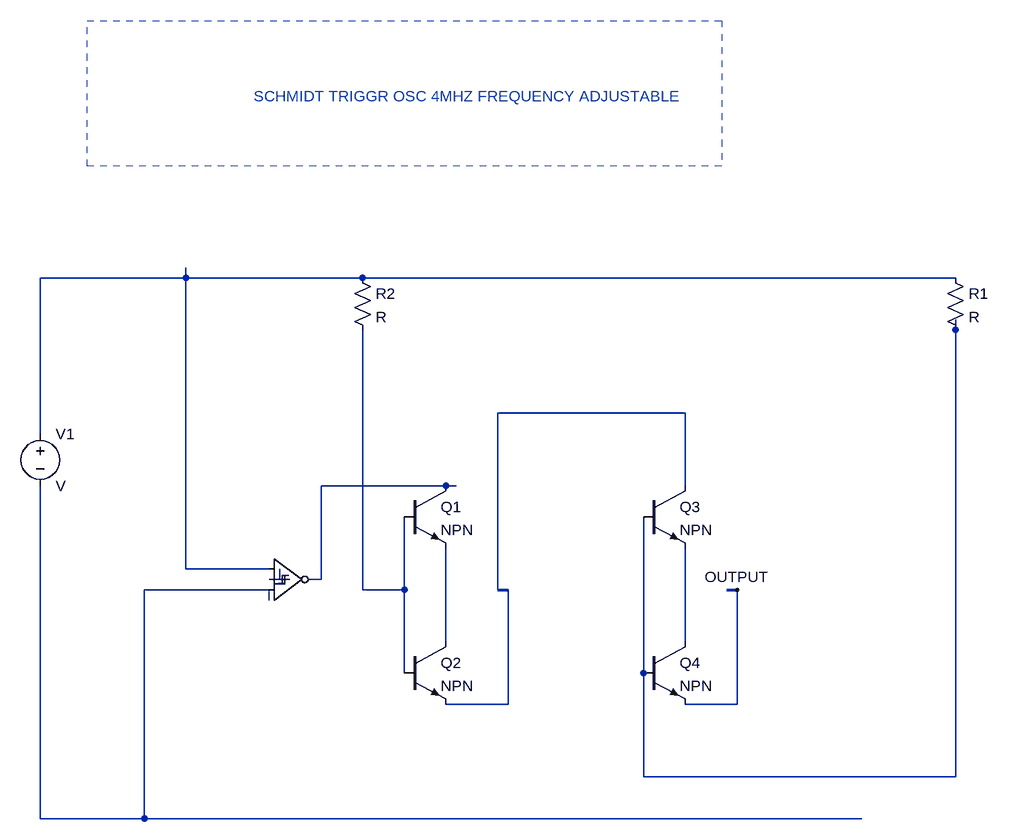
[diagram p0: schematic oscillatorModulatorQuartz.asc]
oscillatorModulatorQuartz.asc, the LTspice schematic file:
Version 4
SHEET 1 880 680
WIRE -480 -368 -480 -384
WIRE -480 -368 -704 -368
WIRE -208 -368 -480 -368
WIRE 704 -368 -208 -368
WIRE 704 -288 704 -304
WIRE 288 -160 0 -160
WIRE -704 -128 -704 -368
WIRE -80 -48 -272 -48
WIRE -64 -48 -80 -48
WIRE 288 -48 288 -160
WIRE -480 80 -480 -368
WIRE -352 80 -480 80
WIRE -336 96 -336 80
WIRE -272 96 -272 -48
WIRE -272 96 -288 96
WIRE -352 112 -544 112
WIRE -208 112 -208 -288
WIRE -144 112 -144 0
WIRE -144 112 -208 112
WIRE 0 112 0 -160
WIRE -80 192 -80 48
WIRE 288 192 288 48
WIRE -144 240 -144 112
WIRE 224 240 224 0
WIRE 16 288 16 112
WIRE 16 288 -80 288
WIRE 368 288 368 112
WIRE 368 288 288 288
WIRE 224 400 224 240
WIRE 704 400 704 -288
WIRE 704 400 224 400
WIRE -704 464 -704 -48
WIRE -544 464 -544 112
WIRE -544 464 -704 464
WIRE 560 464 -544 464
FLAG 368 112 OUTPUT
FLAG -336 96 COM
BUSTAP 0 112 16 112
BUSTAP 352 112 368 112
SYMBOL Digital/diffschmtinv -352 32 R0
WINDOW 0 144 151 Invisible 2
SYMATTR InstName s
SYMBOL npn -144 -48 R0
SYMATTR InstName Q1
SYMBOL npn -144 192 R0
SYMATTR InstName Q2
SYMBOL npn 224 -48 R0
SYMATTR InstName Q3
SYMBOL npn 224 192 R0
SYMATTR InstName Q4
SYMBOL voltage -704 -144 R0
SYMATTR InstName V1
SYMBOL res 688 -384 R0
SYMATTR InstName R1
SYMBOL res -224 -384 R0
SYMATTR InstName R2
TEXT -376 -648 Left 2 ;SCHMIDT TRIGGR OSC 4MHZ FREQUENCY ADJUSTABLE
RECTANGLE Normal -632 -764 344 -540 2

The netlist it stands for:
* oscillatorModulatorQuartz.asc
A§s N001 N005 0 0 0 N004 0 0 SCHMITT
Q1 N004 N006 N007 0 NPN
Q2 N007 N006 N009 0 NPN
Q3 N003 N002 N008 0 NPN
Q4 N008 N002 OUTPUT 0 NPN
V1 N001 N005 V
R1 N001 N002 R
R2 N001 N006 R
.model NPN NPN
.model PNP PNP
.lib standard.bjt
* SCHMIDT TRIGGR OSC 4MHZ FREQUENCY ADJUSTABLE
.backanno
.end